# Altium project UU121_WiFi.PrjPcb
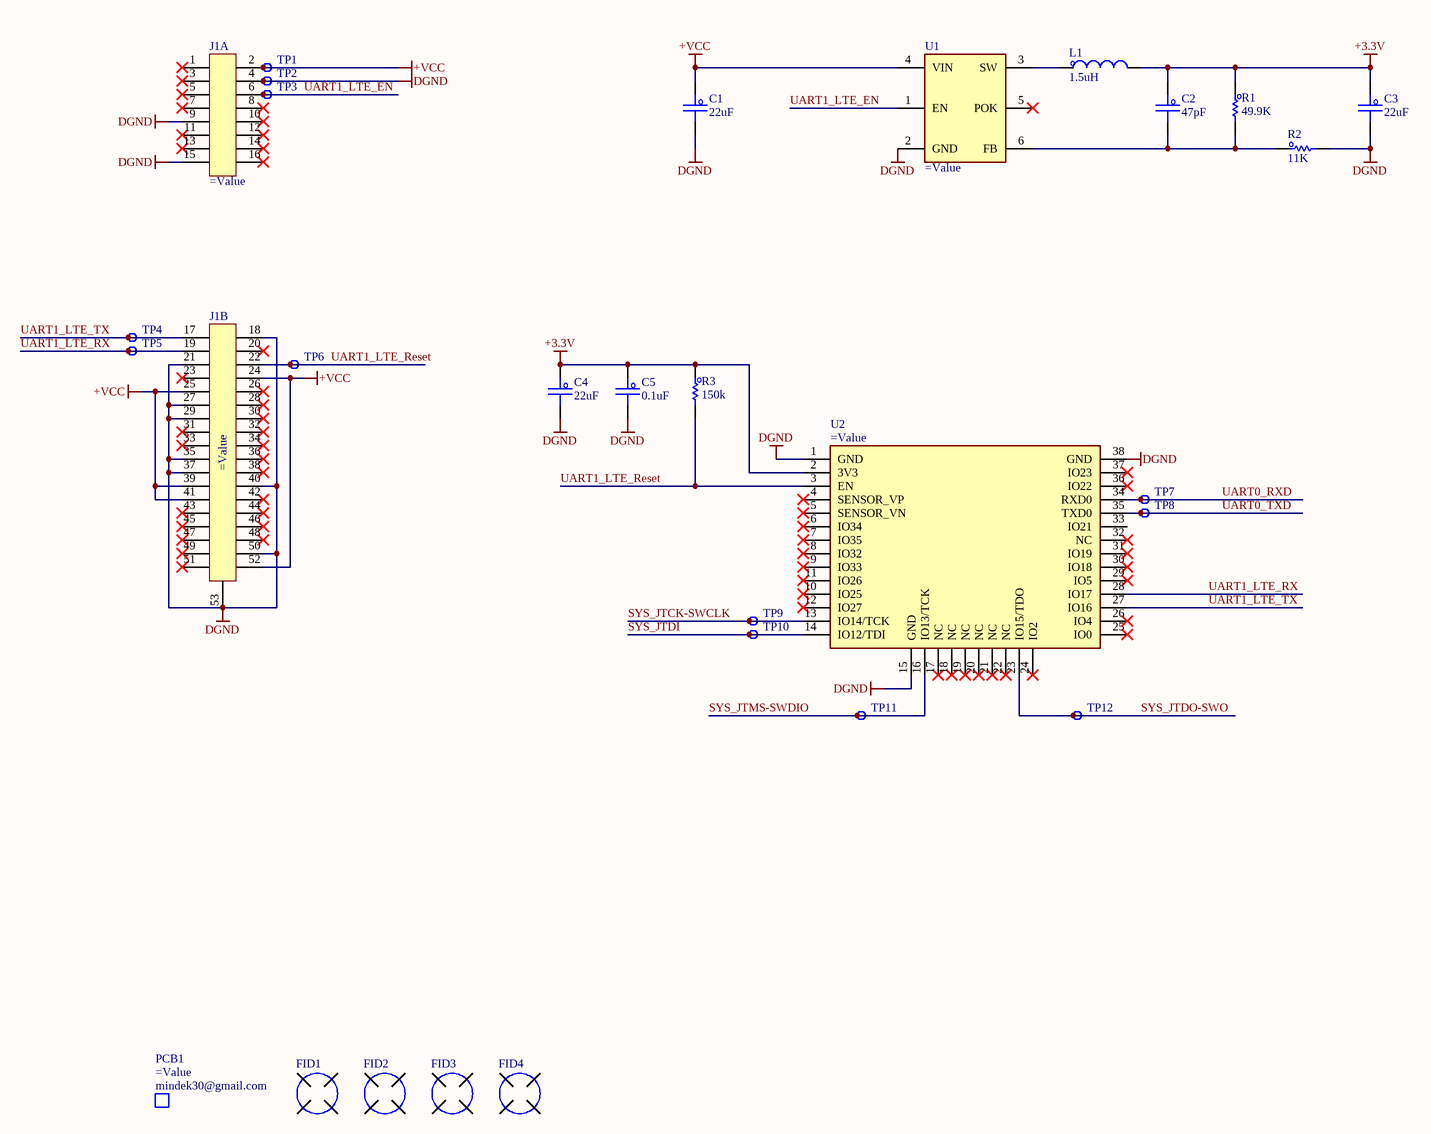
[diagram p0: 0_Overview.SchDoc]
PCB_Name: WIFI-Module; PCB_PN: UU121; PCB_Rev: A0; PCBA_PN: UU121; PCBA_Rev: A0
1 sheet, 29 parts. Net scope: global (net labels, ports and power ports of the same name join across sheets).
Board file: UU121_WiFi.PcbDoc

## Sheet 0_Overview.SchDoc: Overview
size A3; DocumentNumber: 1; SheetNumber: 1; SheetTotal: 6; PageSetup: Record=PageOptions|CenterHorizontal=True|CenterVertical=True|PrintScale=1.01|XCorrection=1.00|YCorrection=1.00|PrintKind=0|BorderSize=5000000|LeftOffset=0|BottomOffset=0|Orientation=2|PaperLength=1000|PaperWidth=1000|Scale=100|PaperSource=7|PrintQuality=-4|MediaType=1|DitherType=10|PaperKind=A3|PrintScaleMode=1

### Parts
C1  22uF  [C_0603]
C2  47pF  [C_0603]
C3  22uF  [C_0603]
C4  22uF  [C_0603]
C5  0.1uF  [C_0603]
FID1  FIDUCIAL  [FID]  (value not drawn)  (no BOM)
FID2  FIDUCIAL  [FID]  (value not drawn)  (no BOM)
FID3  FIDUCIAL  [FID]  (value not drawn)  (no BOM)
FID4  FIDUCIAL  [FID]  (value not drawn)  (no BOM)
J1  (no value)  [PCIeMini-GF-2D-800-1K-S52]  (parts A,B of 2)  (no BOM)
L1  1.5uH  [L_0603]
PCB1  Manufacturer: mindek30@gmail.com  (mechanical)
R1  49.9K  [R_0603]
R2  11K  [R_0603]
R3  150k  [R_0603]
TP1  (no value)  [TP_Testpoint]  (no BOM)
TP2  (no value)  [TP_Testpoint]  (no BOM)
TP3  (no value)  [TP_Testpoint]  (no BOM)
TP4  (no value)  [TP_Testpoint]  (no BOM)
TP5  (no value)  [TP_Testpoint]  (no BOM)
TP6  (no value)  [TP_Testpoint]  (no BOM)
TP7  (no value)  [TP_Testpoint]  (no BOM)
TP8  (no value)  [TP_Testpoint]  (no BOM)
TP9  (no value)  [TP_Testpoint]  (no BOM)
TP10  (no value)  [TP_Testpoint]  (no BOM)
TP11  (no value)  [TP_Testpoint]  (no BOM)
TP12  (no value)  [TP_Testpoint]  (no BOM)
U1  (no value)  [SOT95P270X115-6M]
U2  (no value)  [MODULE_ESP32-WROOM-32UE]

### Nets
+3.3V: C2.1 C3.1 C4.1 C5.1 L1.2 R1.1 R3.1 U2.2(3V3)
+VCC: C1.1 J1.2 J1.24 J1.25 J1.39 J1.41 J1.52 TP1.1 U1.4(VIN)
DGND: C1.2 C3.2 C4.2 C5.2 J1.4 J1.9 J1.15 J1.18 J1.21 J1.27 J1.29 J1.35 J1.37 J1.40 J1.50 J1.53 R2.2 TP2.1 U1.2(GND) U2.1(GND) U2.15(GND) U2.38(GND)
SYS_JTCK-SWCLK: TP9.1 U2.13(IO14/TCK)
SYS_JTDI: TP10.1 U2.14(IO12/TDI)
SYS_JTDO-SWO: TP12.1 U2.23(IO15/TDO)
SYS_JTMS-SWDIO: TP11.1 U2.16(IO13/TCK)
UART0_RXD: TP7.1 U2.34(RXD0)
UART0_TXD: TP8.1 U2.35(TXD0)
UART1_LTE_EN: J1.6 TP3.1 U1.1(EN)
UART1_LTE_Reset: J1.22 R3.2 TP6.1 U2.3(EN)
UART1_LTE_RX: J1.19 TP5.1 U2.28(IO17)
UART1_LTE_TX: J1.17 TP4.1 U2.27(IO16)
NetC2_2: C2.2 R1.2 R2.1 U1.6(FB)
NetL1_1: L1.1 U1.3(SW)

Not connected (* = marked no-connect by the designer): J1 1* 3* 5* 7* 8* 10* 11* 12* 13* 14* 16* 20* 23* 26* 28* 30* 31* 32* 33* 34* 36* 38* 42* 43* 44* 45* 46* 47* 48* 49* 51*; U1 5(POK)*; U2 4(SENSOR_VP)* 5(SENSOR_VN)* 6(IO34)* 7(IO35)* 8(IO32)* 9(IO33)* 10(IO25)* 11(IO26)* 12(IO27)* 17(NC)* 18(NC)* 19(NC)* 20(NC)* 21(NC)* 22(NC)* 24(IO2)* 25(IO0)* 26(IO4)* 29(IO5)* 30(IO18)* 31(IO19)* 32(NC)* 33(IO21) 36(IO22)* 37(IO23)*

### Notes on the sheet
- Title :
- Revision :
- ผู้จัดทำ:
- Size:
- A3
- Time:
- ผู้เขียน:
- บริษัท ยูนิเวอร์แซล ยูทีลิตี้ส์ จำกัด (มหาชน) เลขที่ 1 อาคาร อีสท์วอเตอร์ ชั้น 18 ซอยวิภาวดีรังสิต 5 แขวงจอมพล เขตจตุจักร กรุงเทพฯ 10900
  Tel : +662-272-1688
  Fax :+662-2721690-1
- -
- Sheet:
- of
- ผู้อำนวยการ
- ผู้ตรวจสอบ:
- Number:
- กรรมการผู้จัดการ:
- File:

### Library data of the parts
C1 C3 C4 = C_Capacitor: CAP CER 22UF 10V X5R 0603; Manufacturer: TDK Corporation; PartNumber: C1608X5R1A226M080AC; PackageReference: 0603; PartID: 445-9077-1-ND; Value2: 10V; Value: 22uF; Value3: *
C2 = C_Capacitor: CAP CER 47PF 50V X7R 0603; Manufacturer: KEMET; PartNumber: C0603C470J5RAC7867; PackageReference: 0603; PartID: 399-C0603C470J5RAC7867CT-ND; Value2: 50V; Value: 47pF; Value3: *
C5 = C_Capacitor: CAP CER 0.1UF 50V X7R 0603; Manufacturer: KEMET; PartNumber: C0603C104K5RACTU; PackageReference: 0603; PartID: 399-5089-1-ND; Value2: 50V; Value: 0.1uF; Value3: *
FID1-FID4 = FID_FIDUCIAL: Manufacturer: mindek30@gmail.com; PartNumber: UU121_A0; Value2: Non SE; Value: Non SE; PartID: A0; PackageReference: Non SE; Value3: Non SE
J1 = CON_PCI-E-52P: CONN PCI EXP MINI FEMALE 52POS; PartNumber: 2041119-1; Manufacturer: TE Connectivity AMP Connectors; Value: 2041119-1; PartID: A108265CT-ND; PackageReference: *; Value2: *; Value3: *
L1 = L_Inductor: 10µH Shielded Multilayer Inductor 250mA 1.05Ohm 0603 (1608 Metric); Manufacturer: Taiyo Yuden; PartNumber: MBKK1608T1R5M; Value2: 1Mhz; Value: 1.5uH; PackageReference: 0603; PartID: 587-4149-1-ND; Value3: *
PCB1 = PCB_Bare: BARE PCB; PartNumber: UU121_A0; PackageReference: Non SE; PartID: A0; Value2: =JobFile_Title; Value: =PartNumber; Value3: UU121_A0
R1 = R_Resister: RES 120K OHM 5% 1/10W 0603; Manufacturer: Vishay Dale; PartNumber: CRCW060349K9FKEAC; Value2: 0.1W; Value: 49.9K; PackageReference: 0603; PartID: 541-3989-1-ND; Value3: *
R2 = R_Resister: RES 11K OHM 1% 1/10W 0603; Manufacturer: Vishay Dale; PartNumber: CRCW060311K0FKEAC; Value2: 0.1W; Value: 11K; PackageReference: 0603; PartID: 541-5146-1-ND; Value3: *
R3 = R_Resister: RES SMD 150K OHM 1% 1/10W 0603; Manufacturer: Vishay Dale; PartNumber: CRCW0603150KFKEAC; Value2: 0.1W; Value: 150k; PackageReference: 0603; PartID: 541-4034-1-ND; Value3: *
TP1-TP12 = TP_TestPoint: TestPoint; Manufacturer: *; PackageReference: *; PartID: *; PartNumber: *; Value2: *; Value3: *
  TP1-TP6: Revision: July-2002: Re-released for DXP Platform.
U1 = IC_PMS_JW5222: DC DC CONVERTER 5V 5W; PartNumber: JW5222; Manufacturer: JoulWatt Tech; Value: JW5222; PartID: C371424; PackageReference: SOT-23-5; Value2: *; Value3: *
U2 = IC_MCU_ESP32-WROOM-32UE: RX TXRX MODULE WIFI U.FL SMD; Manufacturer: Espressif Systems; PartNumber: ESP32-WROOM-32UE (8MB); Value: ESP32-WROOM-32UE (8MB); PackageReference: 38-SMD; PartID: 1965-ESP32-WROOM-32UE(8MB)CT-ND